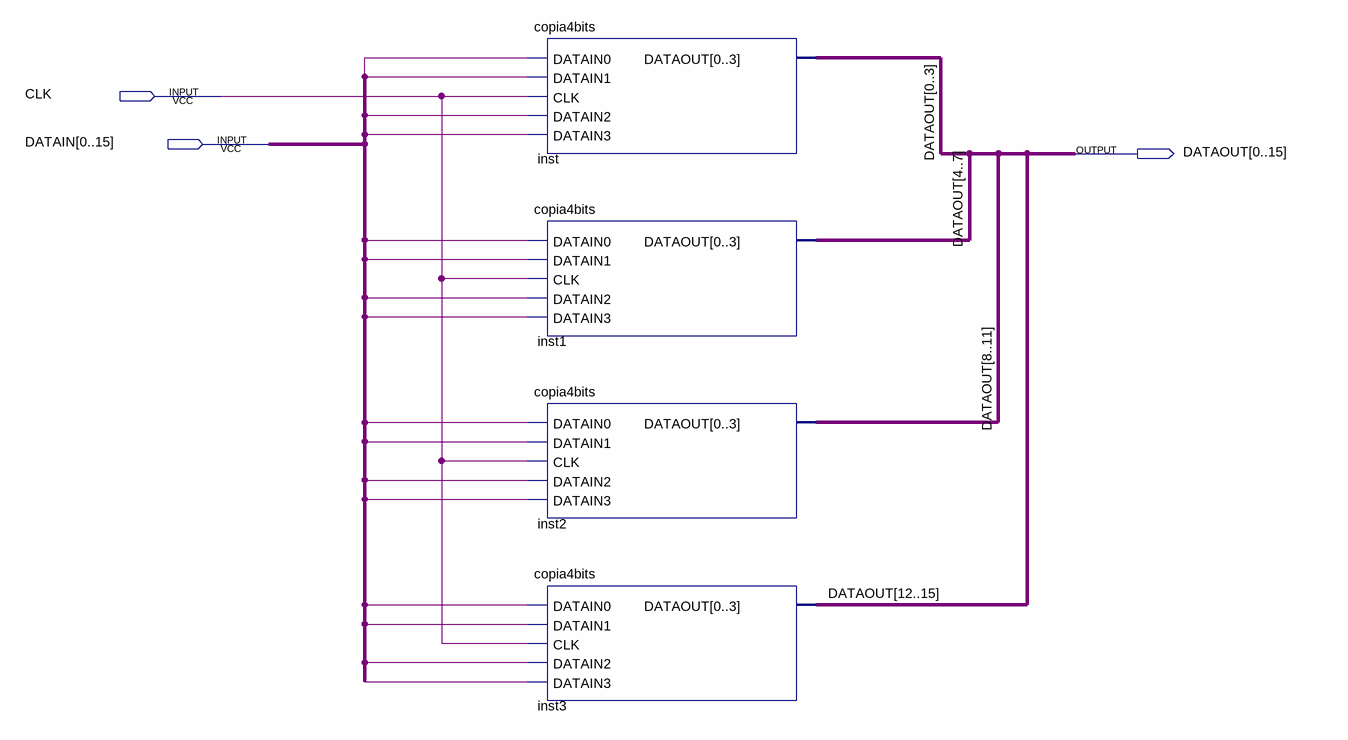
[diagram p0: schematic sheet]
// Quartus schematic copia16bits.bdf as structural Verilog: 4 symbols, 3 pins
module copia16bits (
  input  CLK,
  input  [0:15] DATAIN,
  output [0:15] DATAOUT
);

  wire undriven, undriven_2, undriven_3, undriven_4, undriven_5, undriven_6, undriven_7, undriven_8,
       undriven_9, undriven_10, undriven_11, undriven_12, undriven_13, undriven_14, undriven_15;

  copia4bits inst (
    .DATAIN0(undriven), .DATAIN1(undriven), .CLK(CLK), .DATAIN2(undriven_2), .DATAIN3(undriven_3),
    .DATAOUT(DATAOUT[0:3]));
  copia4bits inst1 (
    .DATAIN0(undriven_4), .DATAIN1(undriven_5), .CLK(CLK), .DATAIN2(undriven_6), .DATAIN3(undriven_7),
    .DATAOUT(DATAOUT[4:7]));
  copia4bits inst2 (
    .DATAIN0(undriven_8), .DATAIN1(undriven_9), .CLK(CLK), .DATAIN2(undriven_10), .DATAIN3(undriven_11),
    .DATAOUT(DATAOUT[8:11]));
  copia4bits inst3 (
    .DATAIN0(undriven_12), .DATAIN1(undriven_13), .CLK(CLK), .DATAIN2(undriven_14), .DATAIN3(undriven_15),
    .DATAOUT(DATAOUT[12:15]));
endmodule
